# Altium schematic sheet MCU.SchDoc
size A4
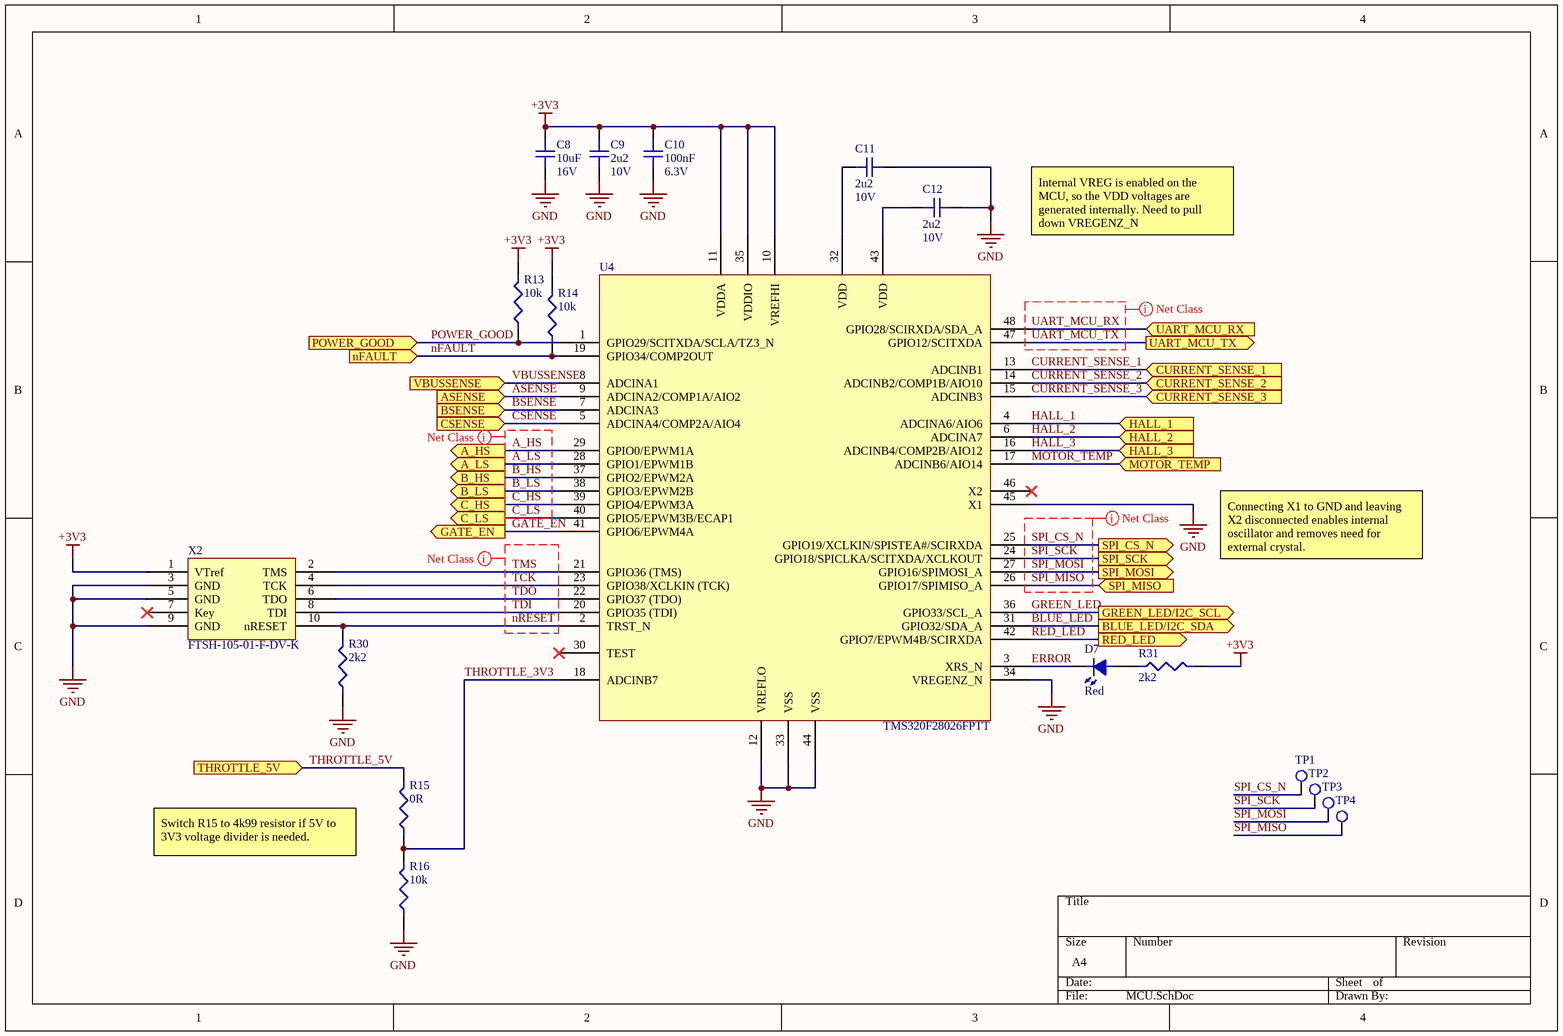
[diagram p0: MCU.SchDoc]

## Parts
C8  10uF  Voltage Rating: 16V  [C0805]
C9  2u2  Voltage Rating: 10V  [C0402]
C10  100nF  Voltage Rating: 6.3V  [C0402]
C11  2u2  Voltage Rating: 10V  [C0402]
C12  2u2  Voltage Rating: 10V  [C0402]
D7  Red  [LED_0603]
R13  10k  [R0402]
R14  10k  [R0402]
R15  0R  [R0402]
R16  10k  [R0402]
R30  2k2  [R0402]
R31  2k2  [R0402]
TP1  5015  [TP_HOOK]  (value not drawn)
TP2  5015  [TP_HOOK]  (value not drawn)
TP3  5015  [TP_HOOK]  (value not drawn)
TP4  5015  [TP_HOOK]  (value not drawn)
U4  TMS320F28026FPTT  [PQFP-48]
X2  FTSH-105-01-F-DV-K  [JTAG_50mil_10pin]

## Ports
A_HS, A_LS, ASENSE, B_HS, B_LS, BLUE_LED/I2C_SDA, BSENSE, C_HS, C_LS, CSENSE, CURRENT_SENSE_1, CURRENT_SENSE_2, CURRENT_SENSE_3, GATE_EN, GREEN_LED/I2C_SCL, HALL_1, HALL_2, HALL_3, MOTOR_TEMP, nFAULT, POWER_GOOD, RED_LED, SPI_CS_N, SPI_MISO, SPI_MOSI, SPI_SCK, THROTTLE_5V, UART_MCU_RX, UART_MCU_TX, VBUSSENSE

## Nets
+3V3: C8.2 C9.2 C10.2 R13.2 R14.2 R31.2 U4.10(VREFHI) U4.11(VDDA) U4.35(VDDIO) X2.1(VTref)
GND: C8.1 C9.1 C10.1 C11.2 C12.2 R16.1 R30.1 U4.12(VREFLO) U4.33(VSS) U4.34(VREGENZ_N) U4.44(VSS) U4.45(X1) X2.3(GND) X2.5(GND) X2.9(GND)
A_HS: U4.29(GPIO0/EPWM1A) ; port A_HS
A_LS: U4.28(GPIO1/EPWM1B) ; port A_LS
ASENSE: U4.9(ADCINA2/COMP1A/AIO2) ; port ASENSE
B_HS: U4.37(GPIO2/EPWM2A) ; port B_HS
B_LS: U4.38(GPIO3/EPWM2B) ; port B_LS
BLUE_LED: U4.31(GPIO32/SDA_A) ; port BLUE_LED/I2C_SDA
BSENSE: U4.7(ADCINA3) ; port BSENSE
C_HS: U4.39(GPIO4/EPWM3A) ; port C_HS
C_LS: U4.40(GPIO5/EPWM3B/ECAP1) ; port C_LS
CSENSE: U4.5(ADCINA4/COMP2A/AIO4) ; port CSENSE
CURRENT_SENSE_1: U4.13(ADCINB1) ; port CURRENT_SENSE_1
CURRENT_SENSE_2: U4.14(ADCINB2/COMP1B/AIO10) ; port CURRENT_SENSE_2
CURRENT_SENSE_3: U4.15(ADCINB3) ; port CURRENT_SENSE_3
ERROR: D7.2 U4.3(XRS_N)
GATE_EN: U4.41(GPIO6/EPWM4A) ; port GATE_EN
GREEN_LED: U4.36(GPIO33/SCL_A) ; port GREEN_LED/I2C_SCL
HALL_1: U4.4(ADCINA6/AIO6) ; port HALL_1
HALL_2: U4.6(ADCINA7) ; port HALL_2
HALL_3: U4.16(ADCINB4/COMP2B/AIO12) ; port HALL_3
MOTOR_TEMP: U4.17(ADCINB6/AIO14) ; port MOTOR_TEMP
nFAULT: R14.1 U4.19(GPIO34/COMP2OUT) ; port nFAULT
nRESET: R30.2 U4.2(TRST_N) X2.10(nRESET)
POWER_GOOD: R13.1 U4.1(GPIO29/SCITXDA/SCLA/TZ3_N) ; port POWER_GOOD
RED_LED: U4.42(GPIO7/EPWM4B/SCIRXDA) ; port RED_LED
SPI_CS_N: TP1.1 U4.25(GPIO19/XCLKIN/SPISTEA#/SCIRXDA) ; port SPI_CS_N
SPI_MISO: TP4.1 U4.26(GPIO17/SPIMISO_A) ; port SPI_MISO
SPI_MOSI: TP3.1 U4.27(GPIO16/SPIMOSI_A) ; port SPI_MOSI
SPI_SCK: TP2.1 U4.24(GPIO18/SPICLKA/SCITXDA/XCLKOUT) ; port SPI_SCK
TCK: U4.23(GPIO38/XCLKIN_(TCK)) X2.4(TCK)
TDI: U4.20(GPIO35_(TDI)) X2.8(TDI)
TDO: U4.22(GPIO37_(TDO)) X2.6(TDO)
THROTTLE_3V3: R15.1 R16.2 U4.18(ADCINB7)
THROTTLE_5V: R15.2 ; port THROTTLE_5V
TMS: U4.21(GPIO36_(TMS)) X2.2(TMS)
UART_MCU_RX: U4.48(GPIO28/SCIRXDA/SDA_A) ; port UART_MCU_RX
UART_MCU_TX: U4.47(GPIO12/SCITXDA) ; port UART_MCU_TX
VBUSSENSE: U4.8(ADCINA1) ; port VBUSSENSE
NetC11_1: C11.1 U4.32(VDD)
NetC12_1: C12.1 U4.43(VDD)
NetD7_1: D7.1 R31.1

Not connected (* = marked no-connect by the designer): U4 30(TEST)* 46(X2)*; X2 7(Key)*

## Layout directives
net class SPI: SPI_CS_N, SPI_MISO, SPI_MOSI, SPI_SCK
net class PWM_GATE_DRIVES: A_HS, A_LS, B_HS, B_LS, C_HS, C_LS
net class JTAG: nRESET, TCK, TDI, TDO, TMS
net class UART: UART_MCU_RX, UART_MCU_TX

## Notes on the sheet
- Internal VREG is enabled on the MCU, so the VDD voltages are generated internally. Need to pull down VREGENZ_N
- Connecting X1 to GND and leaving X2 disconnected enables internal oscillator and removes need for external crystal.
- Switch R15 to 4k99 resistor if 5V to 3V3 voltage divider is needed.

## Library data of the parts
C8 = CL21A106KOQNNNE: CAP CER 10uF 16V X5R 10% SMD 0805 85C T/R; Manufacturer: Samsung; Dielectric: X7R; Supplier 1: Digi-Key; Manufacturer Part Number: CL21A106KOQNNNE; Stock 1: 20000; Pricing 1: 1=0.21, 10=0.148, 100=0.0698, 500=0.0489, 1000=0.0405 (USD); Mount: Surface Mount; Case/Package: 0805; Case Code (Metric): 2012; Case Code (Imperial): 0805; Min Operating Temperature: -55°C; Max Operating Temperature: 85°C; Package Quantity: 1; Packaging: Tape and Reel; Capacitance: 10uF; Tolerance: 10%; Voltage Rating (DC): 16V; Voltage: 16V; Length: 2mm; Height: 1.25mm; Width: 0.049inch; Thickness: 0.055inch; Depth: 1.25mm; Radiation Hardening: No; Lead Free: Lead Free; ComponentLink1URL: https://datasheet.ciiva.com/25798/cl21a106koqnnne-25798133.pdf; ComponentLink1Description: https://datasheet.ciiva.com/25798/cl21a106koqnnne-25798133.pdf; ComponentLink2URL: https://datasheet.ciiva.com/16740/cl05b104kq5nnnc-16740697.pdf; ComponentLink2Description: https://datasheet.ciiva.com/16740/cl05b104kq5nnnc-16740697.pdf; ComponentLink3URL: https://datasheet.ciiva.com/15216/getdatasheetpartid-358435-15216234.pdf; ComponentLink3Description: https://datasheet.ciiva.com/15216/getdatasheetpartid-358435-15216234.pdf; Supplier Part Number 1: 1276-1096-1-ND
C9 C11 C12 = GRM155R61A225ME95D: CAP CER 2.2uF 10V X5R 20% SMD 0402 85C Paper T/R; Manufacturer: Murata; Supplier 1: Digi-Key; Manufacturer Part Number: GRM155R61A225ME95D; Stock 1: 100000; Pricing 1: 1=0.13, 10=0.096, 100=0.045, 500=0.0316, 1000=0.0261, 2500=0.0243, 5000=0.0223 (USD); Mount: Surface Mount; Case/Package: 0402; Case Code (Metric): 1005; Case Code (Imperial): 0402; Min Operating Temperature: -55°C; Max Operating Temperature: 85°C; Tolerance: 20%; Packaging: Tape and Reel; Dielectric: X5R; Capacitance: 2.2uF; Voltage Rating (DC): 10V; Length: 0.039inch; Width: 0.02inch; Thickness: 0.022inch; Depth: 0.5mm; Supplier Part Number 1: 490-10452-1-ND
C10 = CL05B104KQ5NNNC: CAP CER 0.1uF 6.3V X7R 10% SMD 0402 125C Paper T/R; Manufacturer: Samsung; Supplier 1: Digi-Key; Manufacturer Part Number: CL05B104KQ5NNNC; Stock 1: 100000; Pricing 1: 1=0.1, 10=0.03, 100=0.0134, 500=0.0096, 1000=0.0075, 2500=0.0068, 5000=0.0063 (USD); Mount: Surface Mount; Case/Package: 0402; Case Code (Metric): 1005; Case Code (Imperial): 0402; Min Operating Temperature: -55°C; Max Operating Temperature: 125°C; Tolerance: 10%; Packaging: Tape and Reel; Capacitance: 100nF; Dielectric: X7R; Voltage Rating (DC): 6.3V; Length: 1mm; Height: 0.5mm; Width: 0.02inch; Thickness: 0.022inch; Depth: 0.5mm; Radiation Hardening: No; Lead Free: Lead Free; Supplier Part Number 1: 1276-1511-1-ND
D7 = LTST-C191KRKT: LED RED CLEAR 0603 SMD; Manufacturer: Vishay Lite-On; Lens Colour: Colorless; Power Rating: 75mW; Luminous Intensity: 54mcd; Viewing Angle: 130°; Forward Voltage: 2V; Lens Style: Clear,Diffused,Colorless,Rectangular; Forward Current: 30mA; Dominant Wavelength: 631nm; Test Current: 20mA; Number of Elements: 1; Wavelength: 639nm; Reverse Voltage: 5V; Supplier 1: Digi-Key; Manufacturer Part Number: LTST-C191KRKT; Stock 1: 684119; Pricing 1: 1=0.29, 10=0.211, 25=0.1556, 100=0.1111, 250=0.0756, 500=0.0667, 1000=0.0522, 2500=0.0511 (USD); Mount: Surface Mount; Case/Package: 0603; Number of Pins: 2; Colour: Red; Case Code (Metric): 1608; Case Code (Imperial): 0603; Min Operating Temperature: -55°C; Max Operating Temperature: 85°C; Packaging: Tape and Reel; Package Quantity: 1; Illumination Colour: Red; Lens Transparency: Clear; Power Dissipation: 75mW; Number of LEDs: 1; Voltage: 2V; Length: 1.6mm; Height: 0.55mm; Width: 0.8mm; Depth: 0.8mm; Radiation Hardening: No; Lead Free: Lead Free; ComponentLink1URL: https://datasheet.ciiva.com/11773/0900766b80dc02b2-11773601.pdf; ComponentLink1Description: https://datasheet.ciiva.com/11773/0900766b80dc02b2-11773601.pdf; ComponentLink2URL: https://datasheet.ciiva.com/2109/s-110-ltst-c191krkt-2109970.pdf; ComponentLink2Description: https://datasheet.ciiva.com/2109/s-110-ltst-c191krkt-2109970.pdf; ComponentLink3URL: https://datasheet.ciiva.com/2109/s-110-ltst-c191krkt-2109971.pdf; ComponentLink3Description: https://datasheet.ciiva.com/2109/s-110-ltst-c191krkt-2109971.pdf; ComponentLink4URL: https://datasheet.ciiva.com/16212/ltst-c191krkt-16212419.pdf; ComponentLink4Description: https://datasheet.ciiva.com/16212/ltst-c191krkt-16212419.pdf; ComponentLink5URL: https://datasheet.ciiva.com/2109/s-110-ltst-c191krkt-2109972.pdf; ComponentLink5Description: https://datasheet.ciiva.com/2109/s-110-ltst-c191krkt-2109972.pdf; ComponentLink6URL: https://datasheet.ciiva.com/15117/getdatasheetpartid-141922-15117737.pdf; ComponentLink6Description: https://datasheet.ciiva.com/15117/getdatasheetpartid-141922-15117737.pdf; ComponentLink7URL: https://datasheet.ciiva.com/12400/lite-on-ltst-c191krkt-190135-12400910.pdf; ComponentLink7Description: https://datasheet.ciiva.com/12400/lite-on-ltst-c191krkt-190135-12400910.pdf; Supplier Part Number 1: 160-1447-1-ND
R13 R14 R16 = RC0402JR-0710KL: RES SMD 10K OHM 5% 1/16W 0402; Manufacturer: Yageo; Resistance: 10kR; Power Rating: 62.5mW; Voltage Rating: 50V; Temperature Coefficient: 100ppm/°C; Max Power Dissipation: 63mW; Supplier 1: Digi-Key; Manufacturer Part Number: RC0402JR-0710KL; Stock 1: 47303622; Pricing 1: 1=0.1, 10=0.018, 100=0.0073, 1000=0.0033, 2500=0.0029, 5000=0.0024 (USD); Case/Package: 0402; Case Code (Metric): 1005; Case Code (Imperial): 0402; Min Operating Temperature: -55°C; Max Operating Temperature: 155°C; Packaging: Tape and Reel; Tolerance: 5%; Package Quantity: 1; Composition: Thick Film; Number of Terminations: 2; Termination: SMD/SMT; Military Standard: Not; Features: Moisture Resistant; Length: 1mm; Height: 0.016inch; Width: 0.02inch; Depth: 0.5mm; REACH SVHC: Unknown; Lead Free: Lead Free; Supplier Part Number 1: 311-10KJRCT-ND
R15 = RC0402JR-070RL: RES SMD 0 OHM 1/16W 0402; Manufacturer: Yageo; Resistance: 0mR; Power Rating: 62.5mW; Tolerance: 5%; Voltage Rating: 50V; Max Power Dissipation: 63mW; Temperature Coefficient: 200ppm/°C; Supplier 1: Digi-Key; Manufacturer Part Number: RC0402JR-070RL; Stock 1: 44333412; Pricing 1: 1=0.1, 10=0.017, 25=0.0124, 50=0.0096, 100=0.007, 250=0.0054, 500=0.0043, 1000=0.0032, 5000=0.0023 (USD); Case/Package: 0402; Contact Plating: Matte,Tin; Case Code (Metric): 1005; Case Code (Imperial): 0402; Min Operating Temperature: -55°C; Max Operating Temperature: 155°C; Packaging: Tape and Reel; Composition: Thick Film; Package Quantity: 1; Number of Terminations: 2; Termination: SMD/SMT; Military Standard: Not; Features: Moisture Resistant; Length: 1mm; Height: 0.016inch; Width: 0.02inch; Depth: 0.5mm; Radiation Hardening: No; REACH SVHC: Unknown; Lead Free: Lead Free; Supplier Part Number 1: 311-0.0JRCT-ND
R30 R31 = RC0402JR-072K2L: RES SMD 2.2K OHM 5% 1/16W 0402; Manufacturer: Yageo; Resistance: 2.2kR; Power Rating: 63mW; Voltage Rating: 50V; Temperature Coefficient: 100ppm/°C; Supplier 1: Digi-Key; Manufacturer Part Number: RC0402JR-072K2L; Stock 1: 7890813; Pricing 1: 1=0.1, 10=0.018, 100=0.0073, 1000=0.0033, 2500=0.0029, 5000=0.0024 (USD); Case/Package: 0402; Weight: 2.3E-05oz; Case Code (Metric): 1005; Case Code (Imperial): 0402; Min Operating Temperature: -55°C; Max Operating Temperature: 155°C; Tolerance: 5%; Packaging: Tape and Reel; Composition: Thick Film; Termination: SMD/SMT; Military Standard: Not; Package Quantity: 1; Number of Terminations: 2; Max Power Dissipation: 63mW; Working Voltage: 50V; Features: Moisture Resistant; Length: 1mm; Height: 0.016inch; Depth: 0.5mm; Width: 0.02inch; REACH SVHC: Unknown; Lead Free: Lead Free; Supplier Part Number 1: 311-2.2KJRCT-ND
TP1-TP4 = 5015: TEST POINT, PCB, SMT; Manufacturer: Keystone Electronics; Number of Ports: 1; Supplier 1: Digi-Key; Manufacturer Part Number: 5015; Stock 1: 1937775; Pricing 1: 1=0.44, 10=0.421, 25=0.3604, 50=0.3064, 100=0.2944, 250=0.2644, 500=0.2524 (USD); Mount: Surface Mount; Colour: White; Contact Material: Bronze; Contact Plating: Tin,Silver,Lead; Material: Bronze,Silver; Package Quantity: 1; Packaging: Tape and Reel; Termination: Solder; Orientation: Straight; Length: 2.66mm; Height: 0.06inch; Thickness: 0.01inch; Depth: 1.01mm; REACH SVHC: No SVHC; Lead Free: Lead Free; ComponentLink1URL: https://datasheet.ciiva.com/2917/5015-2917616.pdf; ComponentLink1Description: https://datasheet.ciiva.com/2917/5015-2917616.pdf; ComponentLink2URL: https://datasheet.ciiva.com/2917/5015-2917617.pdf; ComponentLink2Description: https://datasheet.ciiva.com/2917/5015-2917617.pdf; ComponentLink3URL: https://datasheet.ciiva.com/1123/5015-1123862.pdf; ComponentLink3Description: https://datasheet.ciiva.com/1123/5015-1123862.pdf; ComponentLink4URL: https://datasheet.ciiva.com/16883/70182998-16883734.pdf; ComponentLink4Description: https://datasheet.ciiva.com/16883/70182998-16883734.pdf; Supplier Part Number 1: 36-5015CT-ND
U4 = TMS320F28026FPTT: IC MCU 32-bit Piccolo F2802x C28x RISC 32KB Flash 3.3V 48-Pin LQFP T/R; Manufacturer: Texas Instruments; Min Supply Voltage: 2.97V; Max Supply Voltage: 3.63V; RAM Size: 12KB; Interface: I2C,SPI,UART,USART,SCI; Number of I/Os: 22; Number of Timers/Counters: 3; Frequency: 60MHz; Number of ADC Channels: 8; Oscillator Type: Internal; Data Bus Width: 32b; Max Frequency: 50MHz; Number of UART Channels: 1; Peripherals: Brown-out Detect/Reset,POR,PWM,WDT; Supplier 1: Digi-Key; Manufacturer Part Number: TMS320F28026FPTT; Stock 1: 202; Pricing 1: 1=7.19, 10=6.499, 100=5.3809 (USD); Mount: Surface Mount; Case/Package: LQFP; Number of Pins: 48; Min Operating Temperature: -40°C; Max Operating Temperature: 105°C; Packaging: Tape and Reel; Package Quantity: 250; Operating Supply Voltage: 3.3V; Number of Programmable I/O: 22; Memory Type: FLASH; Memory Size: 32KB; Radiation Hardening: No; REACH SVHC: No SVHC; Lead Free: Lead Free; ComponentLink1URL: https://datasheet.ciiva.com/6656/tms320f28020-6656816.pdf; ComponentLink1Description: https://datasheet.ciiva.com/6656/tms320f28020-6656816.pdf; ComponentLink2URL: https://datasheet.ciiva.com/23944/tms320f28026-23944835.pdf; ComponentLink2Description: https://datasheet.ciiva.com/23944/tms320f28026-23944835.pdf; ComponentLink3URL: https://datasheet.ciiva.com/28626/1827035-28626823.pdf; ComponentLink3Description: https://datasheet.ciiva.com/28626/1827035-28626823.pdf; ComponentLink4URL: https://datasheet.ciiva.com/29722/tms320f28026f-29722007.pdf; ComponentLink4Description: https://datasheet.ciiva.com/29722/tms320f28026f-29722007.pdf; ComponentLink5URL: https://datasheet.ciiva.com/29986/tms320f28026-29986743.pdf; ComponentLink5Description: https://datasheet.ciiva.com/29986/tms320f28026-29986743.pdf; ComponentLink6URL: https://datasheet.ciiva.com/29722/tms320f28026f-29722008.pdf; ComponentLink6Description: https://datasheet.ciiva.com/29722/tms320f28026f-29722008.pdf; ComponentLink7URL: https://datasheet.ciiva.com/29986/tms320f28026-29986744.pdf; ComponentLink7Description: https://datasheet.ciiva.com/29986/tms320f28026-29986744.pdf; ComponentLink8URL: https://datasheet.ciiva.com/16383/sprs523j-317502-16383180.pdf; ComponentLink8Description: https://datasheet.ciiva.com/16383/sprs523j-317502-16383180.pdf; Supplier Part Number 1: 296-36529-ND
X2 = FTSH-105-01-F-DV-K: CONN_JTAG_10pin .050 Connector Dual Header 10 Position Surface Mount; Manufacturer: Samtec; Max Current Rating: 1.75A; Number of Positions: 10; Connector Type: Male Pin; Pitch: 1.27mm; Row Spacing: 0.05inch; Supplier 1: Digi-Key; Manufacturer Part Number: FTSH-105-01-F-DV-K; Stock 1: 18199; Pricing 1: 1=2.9, 10=2.784, 100=2.32, 500=1.972, 1000=1.682, 5000=1.508 (USD); Mount: Surface Mount; Contact Material: Bronze,Copper; Contact Plating: Nickel,Gold; Colour: Black; Housing Colour: Black; Housing Material: Polymer; Min Operating Temperature: -55°C; Max Operating Temperature: 125°C; Number of Rows: 2; Packaging: Rail/Tube; Package Quantity: 1; Termination: Solder; Number of Contacts: 10; Orientation: Straight; Length: 15.2mm; Height: 3.3mm; Contact Mating Length: 0.12inch; Depth: 3.43mm; Radiation Hardening: No; Lead Free: Lead Free; ComponentLink1URL: https://datasheet.ciiva.com/19461/2046846-19461026.pdf; ComponentLink1Description: https://datasheet.ciiva.com/19461/2046846-19461026.pdf; ComponentLink2URL: https://datasheet.ciiva.com/738/ftsh-1xx-xx-xxx-dv-xxx-mkt-738998.pdf; ComponentLink2Description: https://datasheet.ciiva.com/738/ftsh-1xx-xx-xxx-dv-xxx-mkt-738998.pdf; ComponentLink3URL: https://datasheet.ciiva.com/10245/ftsh-mt-10245273.pdf; ComponentLink3Description: https://datasheet.ciiva.com/10245/ftsh-mt-10245273.pdf; ComponentLink4URL: https://datasheet.ciiva.com/16657/ftsh-mt-16657371.pdf; ComponentLink4Description: https://datasheet.ciiva.com/16657/ftsh-mt-16657371.pdf; ComponentLink5URL: https://datasheet.ciiva.com/15195/getdatasheetpartid-133463-15195260.pdf; ComponentLink5Description: https://datasheet.ciiva.com/15195/getdatasheetpartid-133463-15195260.pdf; Supplier Part Number 1: SAM8796-ND